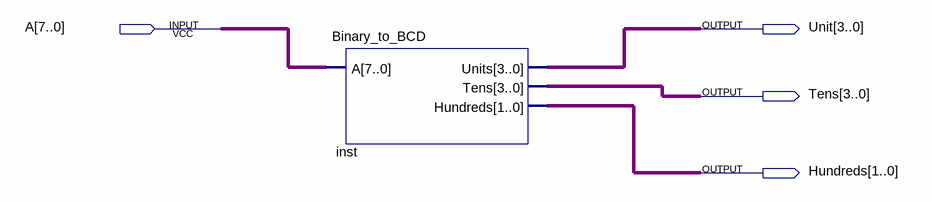
[diagram p0: schematic sheet]
// Quartus schematic TestBinary_to_BCD.bdf as structural Verilog: 1 symbols, 4 pins
module TestBinary_to_BCD (
  input  [7:0] A,
  output [3:0] Unit,
  output [3:0] Tens,
  output [1:0] Hundreds
);

  Binary_to_BCD inst (.A(A), .Units(Unit), .Tens(Tens), .Hundreds(Hundreds));
endmodule
